# Altium schematic sheet LEDs.SchDoc
size A
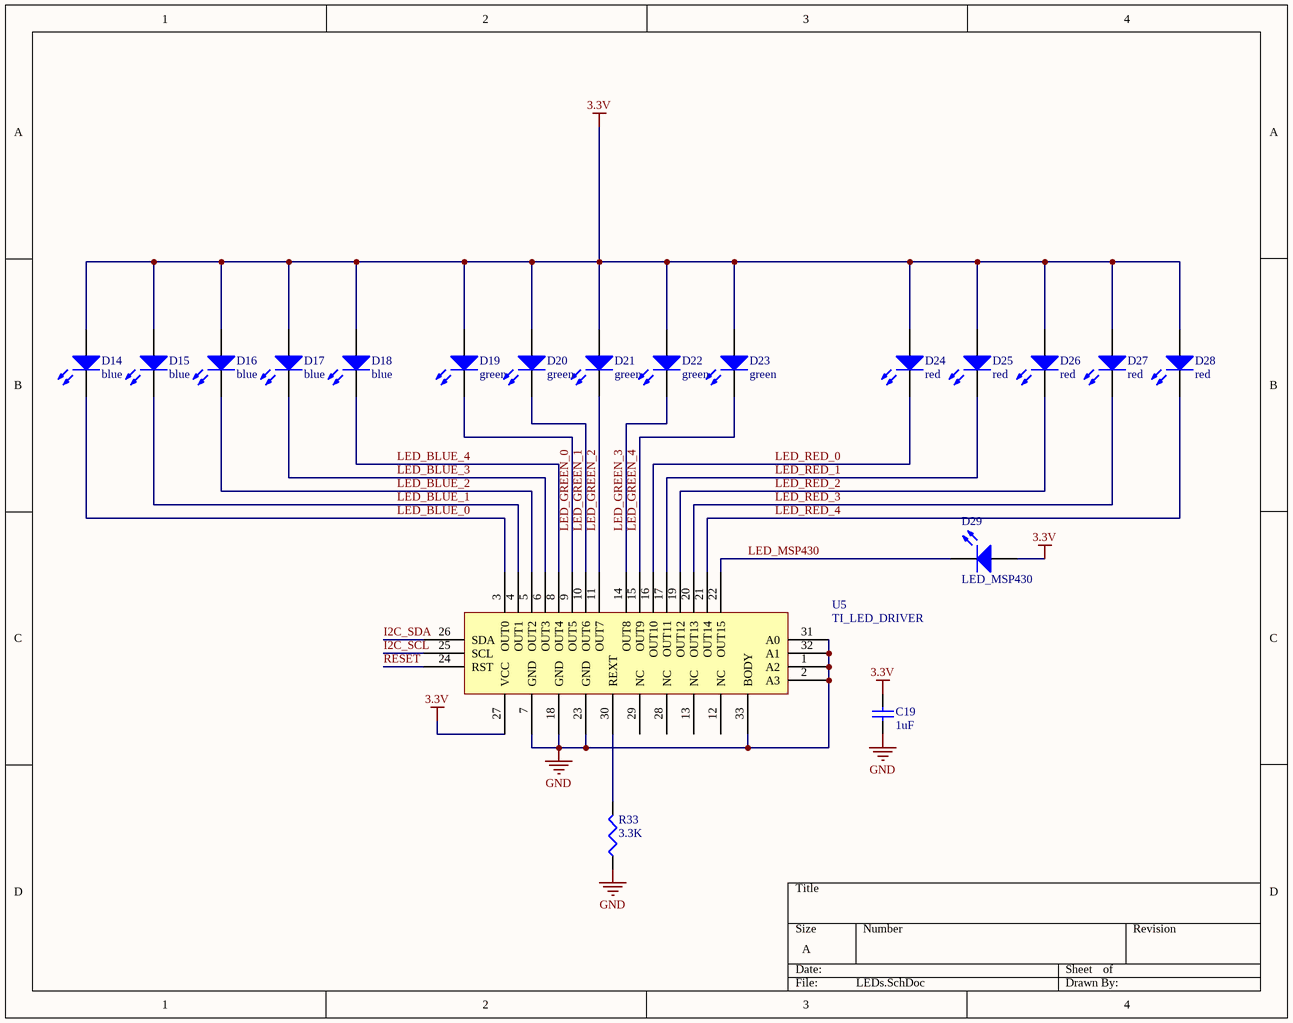
[diagram p0: LEDs.SchDoc]

## Parts
C19  value 1uF  [CAPC1608L]  (hidden comment: Cap Semi)
D14  blue  [SurfaceMount(603)]
D15  blue  [SurfaceMount(603)]
D16  blue  [SurfaceMount(603)]
D17  blue  [SurfaceMount(603)]
D18  blue  [SurfaceMount(603)]
D19  green  [SurfaceMount(603)]
D20  green  [SurfaceMount(603)]
D21  green  [SurfaceMount(603)]
D22  green  [SurfaceMount(603)]
D23  green  [SurfaceMount(603)]
D24  red  [SurfaceMount(603)]
D25  red  [SurfaceMount(603)]
D26  red  [SurfaceMount(603)]
D27  red  [SurfaceMount(603)]
D28  red  [SurfaceMount(603)]
D29  LED_MSP430  [SurfaceMount(603)]
R33  value 3.3K  [RESC1608L]  (hidden comment: Res3)
U5  TI_LED_DRIVER  [QFN32-LEDTLC59116]

## Nets
3.3V: C19.2 D14.1(A) D15.1(A) D16.1(A) D17.1(A) D18.1(A) D19.1(A) D20.1(A) D21.1(A) D22.1(A) D23.1(A) D24.1(A) D25.1(A) D26.1(A) D27.1(A) D28.1(A) D29.1(A) U5.27(VCC)
GND: C19.1 R33.1 U5.1(A2) U5.2(A3) U5.7(GND) U5.18(GND) U5.23(GND) U5.31(A0) U5.32(A1) U5.33(BODY)
I2C_SCL: U5.25(SCL)
I2C_SDA: U5.26(SDA)
LED_BLUE_0: D14.2(K) U5.3(OUT0)
LED_BLUE_1: D15.2(K) U5.4(OUT1)
LED_BLUE_2: D16.2(K) U5.5(OUT2)
LED_BLUE_3: D17.2(K) U5.6(OUT3)
LED_BLUE_4: D18.2(K) U5.8(OUT4)
LED_GREEN_0: D19.2(K) U5.9(OUT5)
LED_GREEN_1: D20.2(K) U5.10(OUT6)
LED_GREEN_2: D21.2(K) U5.11(OUT7)
LED_GREEN_3: D22.2(K) U5.14(OUT8)
LED_GREEN_4: D23.2(K) U5.15(OUT9)
LED_MSP430: D29.2(K) U5.22(OUT15)
LED_RED_0: D24.2(K) U5.16(OUT10)
LED_RED_1: D25.2(K) U5.17(OUT11)
LED_RED_2: D26.2(K) U5.19(OUT12)
LED_RED_3: D27.2(K) U5.20(OUT13)
LED_RED_4: D28.2(K) U5.21(OUT14)
RESET: U5.24(RST)
NetR33_2: R33.2 U5.30(REXT)

Not connected (* = marked no-connect by the designer): U5 12(NC) 13(NC) 28(NC) 29(NC)

## Library data of the parts
C19 = Cap Semi: Capacitor (Semiconductor SIM Model); Published: 8-Jun-2000; LatestRevisionDate: 29-May-2009; LatestRevisionNote: IPC-7351 Footprint Added.; PackageReference: C1206; Publisher: Altium Limited; PackageDescription: Chip Capacitor
D14-D29 = LED
R33 = Res3: Resistor; Published: 8-Jun-2000; LatestRevisionDate: 29-May-2009; LatestRevisionNote: IPC-7351 Footprint Added.; PackageReference: J1-0603; Publisher: Altium Limited; PackageDescription: Chip Resistor
U5 = TLC59116LEDDRIVER